# EAGLE schematic acd run final layout 1 (EAGLE 8.5.0)
2 panel gate automation and control board using a microcontroller
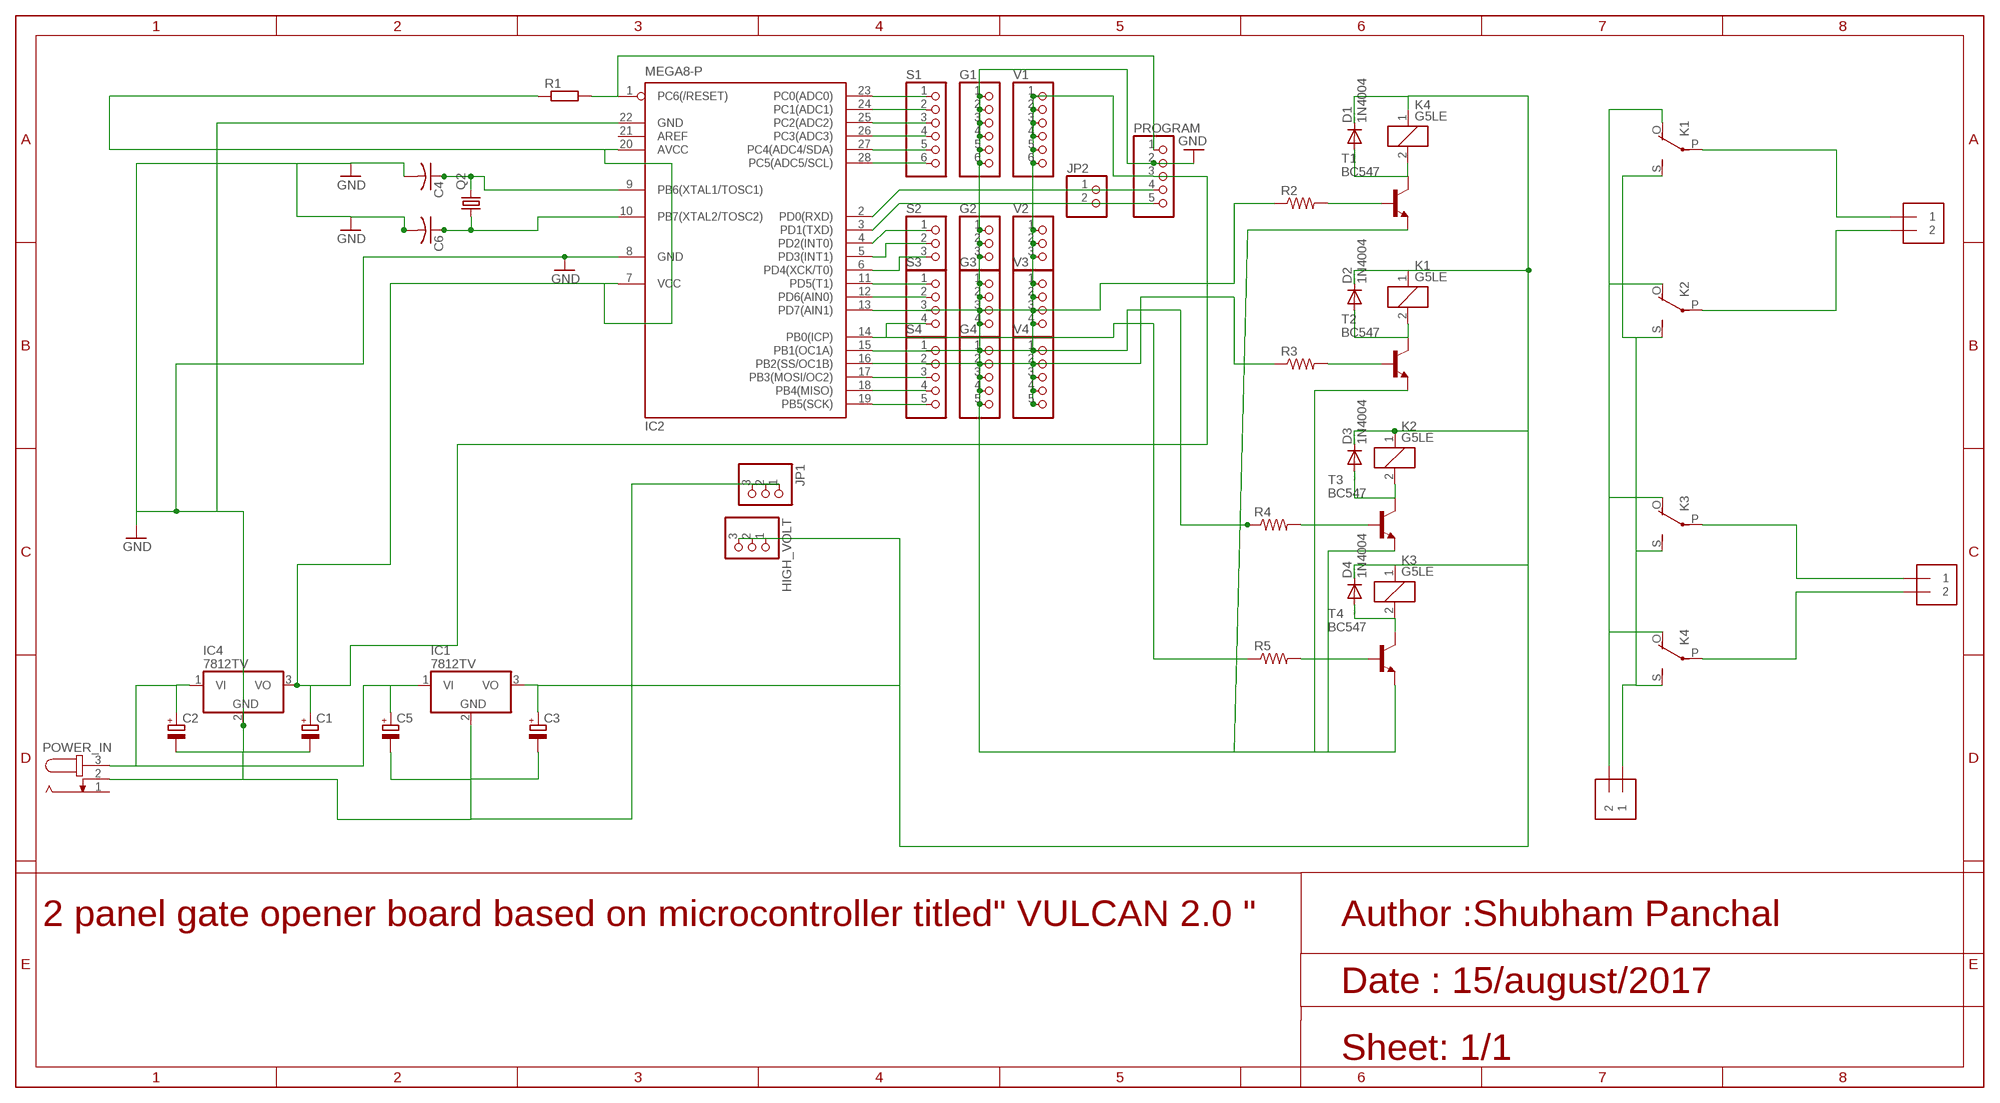
[diagram p0: schematic, sheet 1]

## Parts
BATTERY  1X2-3.5MM  [1X2-3.5MM]
C1  CPOL-EUE2.5-6  [E2,5-6]
C2  CPOL-EUE2.5-6  [E2,5-6]
C3  CPOL-EUE2.5-6  [E2,5-6]
C4  C-US025-024X044  [C025-024X044]
C5  CPOL-EUE2.5-6  [E2,5-6]
C6  C-US025-024X044  [C025-024X044]
D1  1N4004  [DO41-10]
D2  1N4004  [DO41-10]
D3  1N4004  [DO41-10]
D4  1N4004  [DO41-10]
G1  PINHD-1X6  [1X06]
G2  PINHD-1X3  [1X03]
G3  PINHD-1X4  [1X04]
G4  PINHD-1X5  [1X05]
GATE_1  1X2-3.5MM  [1X2-3.5MM]
GATE_2  1X2-3.5MM  [1X2-3.5MM]
HIGH_VOLT  PINHD-1X3  [1X03]
IC1  7812TV  [TO220V]
IC2  MEGA8-P  [DIL28-3]
IC4  7812TV  [TO220V]
JP1  PINHD-1X3  [1X03]
JP2  PINHD-1X2  [1X02]
K1  G5LE  [G5LE]
K2  G5LE  [G5LE]
K3  G5LE  [G5LE]
K4  G5LE  [G5LE]
POWER_IN  JACK-PLUG0  [SPC4077]
PROGRAM  PINHD-1X5  [1X05]
Q2  CRYSTALHC49S  [HC49/S]
R1  R-EU_0204/7  [0204/7]
R2  R-US_0207/10  [0207/10]
R3  R-US_0207/10  [0207/10]
R4  R-US_0207/10  [0207/10]
R5  R-US_0207/10  [0207/10]
S1  PINHD-1X6  [1X06]
S2  PINHD-1X3  [1X03]
S3  PINHD-1X4  [1X04]
S4  PINHD-1X5  [1X05]
T1  BC547  [TO92]
T2  BC547  [TO92]
T3  BC547  [TO92]
T4  BC547  [TO92]
V1  PINHD-1X6  [1X06]
V2  PINHD-1X3  [1X03]
V3  PINHD-1X4  [1X04]
V4  PINHD-1X5  [1X05]

## Nets
GND: C1.- C2.- C3.- C4.2 C5.- C6.2 G1.1 G1.2 G1.3 G1.4 G1.5 G1.6 G2.1 G2.2 G2.3 G3.1 G3.2 G3.3 G3.4 G4.1 G4.2 G4.3 G4.4 G4.5 IC1.2(GND) IC2.8(GND) IC2.22(GND) IC4.2(GND) JP1.1 JP1.2 JP1.3 POWER_IN.2 PROGRAM.2 T1.1(E) T2.1(E) T3.1(E) T4.1(E)
IPJUMPERS: IC2.1(PC6(/RESET)) PROGRAM.1 R1.2
N$1: C4.1 IC2.9(PB6(XTAL1/TOSC1)) Q2.2
N$2: C6.1 IC2.10(PB7(XTAL2/TOSC2)) Q2.1
N$3: IC2.28(PC5(ADC5/SCL)) S1.6
N$4: IC2.27(PC4(ADC4/SDA)) S1.5
N$5: IC2.6(PD4(XCK/T0)) S2.3
N$6: C1.+ IC2.7(VCC) IC2.20(AVCC) IC4.3(VO) PROGRAM.3 R1.1 V1.1 V1.2 V1.3 V1.4 V1.5 V1.6 V2.1 V2.2 V2.3 V3.1 V3.2 V3.3 V3.4 V4.1 V4.2 V4.3 V4.4 V4.5
N$7: C3.+ D1.C D2.C D3.C D4.C HIGH_VOLT.1 HIGH_VOLT.2 HIGH_VOLT.3 IC1.3(VO) K1.1 K2.1 K3.1 K4.1
N$8: IC2.26(PC3(ADC3)) S1.4
N$9: IC2.25(PC2(ADC2)) S1.3
N$10: IC2.24(PC1(ADC1)) S1.2
N$13: IC2.23(PC0(ADC0)) S1.1
N$14: IC2.19(PB5(SCK)) S4.5
N$15: IC2.5(PD3(INT1)) S2.2
N$17: IC2.18(PB4(MISO)) S4.4
N$19: IC2.17(PB3(MOSI/OC2)) S4.3
N$23: IC2.16(PB2(SS/OC1B)) R3.1 S4.2
N$25: IC2.14(PB0(ICP)) R5.1 S3.4
N$35: IC2.13(PD7(AIN1)) R2.1 S3.3
N$40: D1.A K4.2 T1.3(C)
N$41: D2.A K1.2 T2.3(C)
N$43: D3.A K2.2 T3.3(C)
N$44: IC2.4(PD2(INT0)) S2.1
N$45: IC2.3(PD1(TXD)) JP2.2 PROGRAM.5
N$46: IC2.2(PD0(RXD)) JP2.1 PROGRAM.4
N$47: BATTERY.2 K1.O(2:O) K2.O(2:O) K3.O(2:O) K4.O(2:O)
N$48: C2.+ C5.+ IC1.1(VI) IC4.1(VI) POWER_IN.3
N$49: IC2.15(PB1(OC1A)) R4.1 S4.1
N$50: D4.A K3.2 T4.3(C)
N$51: BATTERY.1 K1.S(2:S) K2.S(2:S) K3.S(2:S) K4.S(2:S)
N$52: R5.2 T4.2(B)
N$53: R4.2 T3.2(B)
N$54: IC2.12(PD6(AIN0)) S3.2
N$55: GATE_2.2 K2.P(2:P)
N$56: GATE_1.1 K3.P(2:P)
N$57: GATE_1.2 K4.P(2:P)
N$58: R3.2 T2.2(B)
N$59: R2.2 T1.2(B)
N$60: IC2.11(PD5(T1)) S3.1
R1OUT: GATE_2.1 K1.P(2:P)
Unconnected: IC2.21(AREF) POWER_IN.1

## Notes on the sheet
- 2 panel gate opener board based on microcontroller titled" VULCAN 2.0 " | Author :Shubham Panchal
- Date : 15/august/2017
- Sheet: 1/1

## Library data of the parts
BATTERY GATE_1 GATE_2 = adafruit:1X2: 3.5mm Terminal block http://www.ladyada.net/library/pcb/eaglelibrary.html
C1-C3 C5 = rcl:CPOL-EU: POLARIZED CAPACITOR, European symbol
C4 C6 = rcl:C-US: CAPACITOR, American symbol
D1-D4 = diode:1N4004: DIODE general purpose rectifier, 1 A
G1 S1 V1 = pinhead:PINHD-1X6: PIN HEADER
G2 HIGH_VOLT JP1 S2 V2 = pinhead:PINHD-1X3: PIN HEADER
G3 S3 V3 = pinhead:PINHD-1X4: PIN HEADER
G4 PROGRAM S4 V4 = pinhead:PINHD-1X5: PIN HEADER
IC1 IC4 = linear:78*: Positive VOLTAGE REGULATOR Source: http://cache.national.com/ds/LM/LM78L05.pdf http://www.fairchildsemi.com/ds/LM/LM7805.pdf
IC2 = atmel:MEGA8-P: MICROCONTROLLER 8 Kbytes FLASH, 1 kbytes SRAM, 512 bytes EEPROM, USART, 4-channel 10 bit ADC, 2-channel 8 bit ADC Pin compatible with Atmega48, ATMega88, ATMega168 Source: avr.lbr; OC_FARNELL: unknown; OC_NEWARK: unknown
JP2 = pinhead:PINHD-1X2: PIN HEADER
K1-K4 = relay:G5LE: RELAY 1 x switch, 10 A/120 V AC, 8 A/30 V DC, Omron; OC_FARNELL: unknown; OC_NEWARK: unknown
POWER_IN = con-jack:JACK-PLUG: DC POWER JACK Power Jack, DC, Right Angle, Through Hole, Rated 5A at 16VDC, PC Terminals Distributor: Farnell (www.Farnell.de) Drawing: 84N1161.pdf / 84N1162.pdf Manufacturer: SPC Technology (www.spctechnology.com) Type: SPC4077 / SPC 4078; OC_FARNELL: unknown; OC_NEWARK: unknown
Q2 = crystal:CRYSTAL: CRYSTAL; OC_FARNELL: 1667008; OC_NEWARK: unknown
R1 = rcl:R-EU_: RESISTOR, European symbol
R2-R5 = rcl:R-US_: RESISTOR, American symbol
T1-T4 = transistor:BC547: NPN TRANSISTOR